# Altium schematic sheet generic 32u4.SchDoc
size B
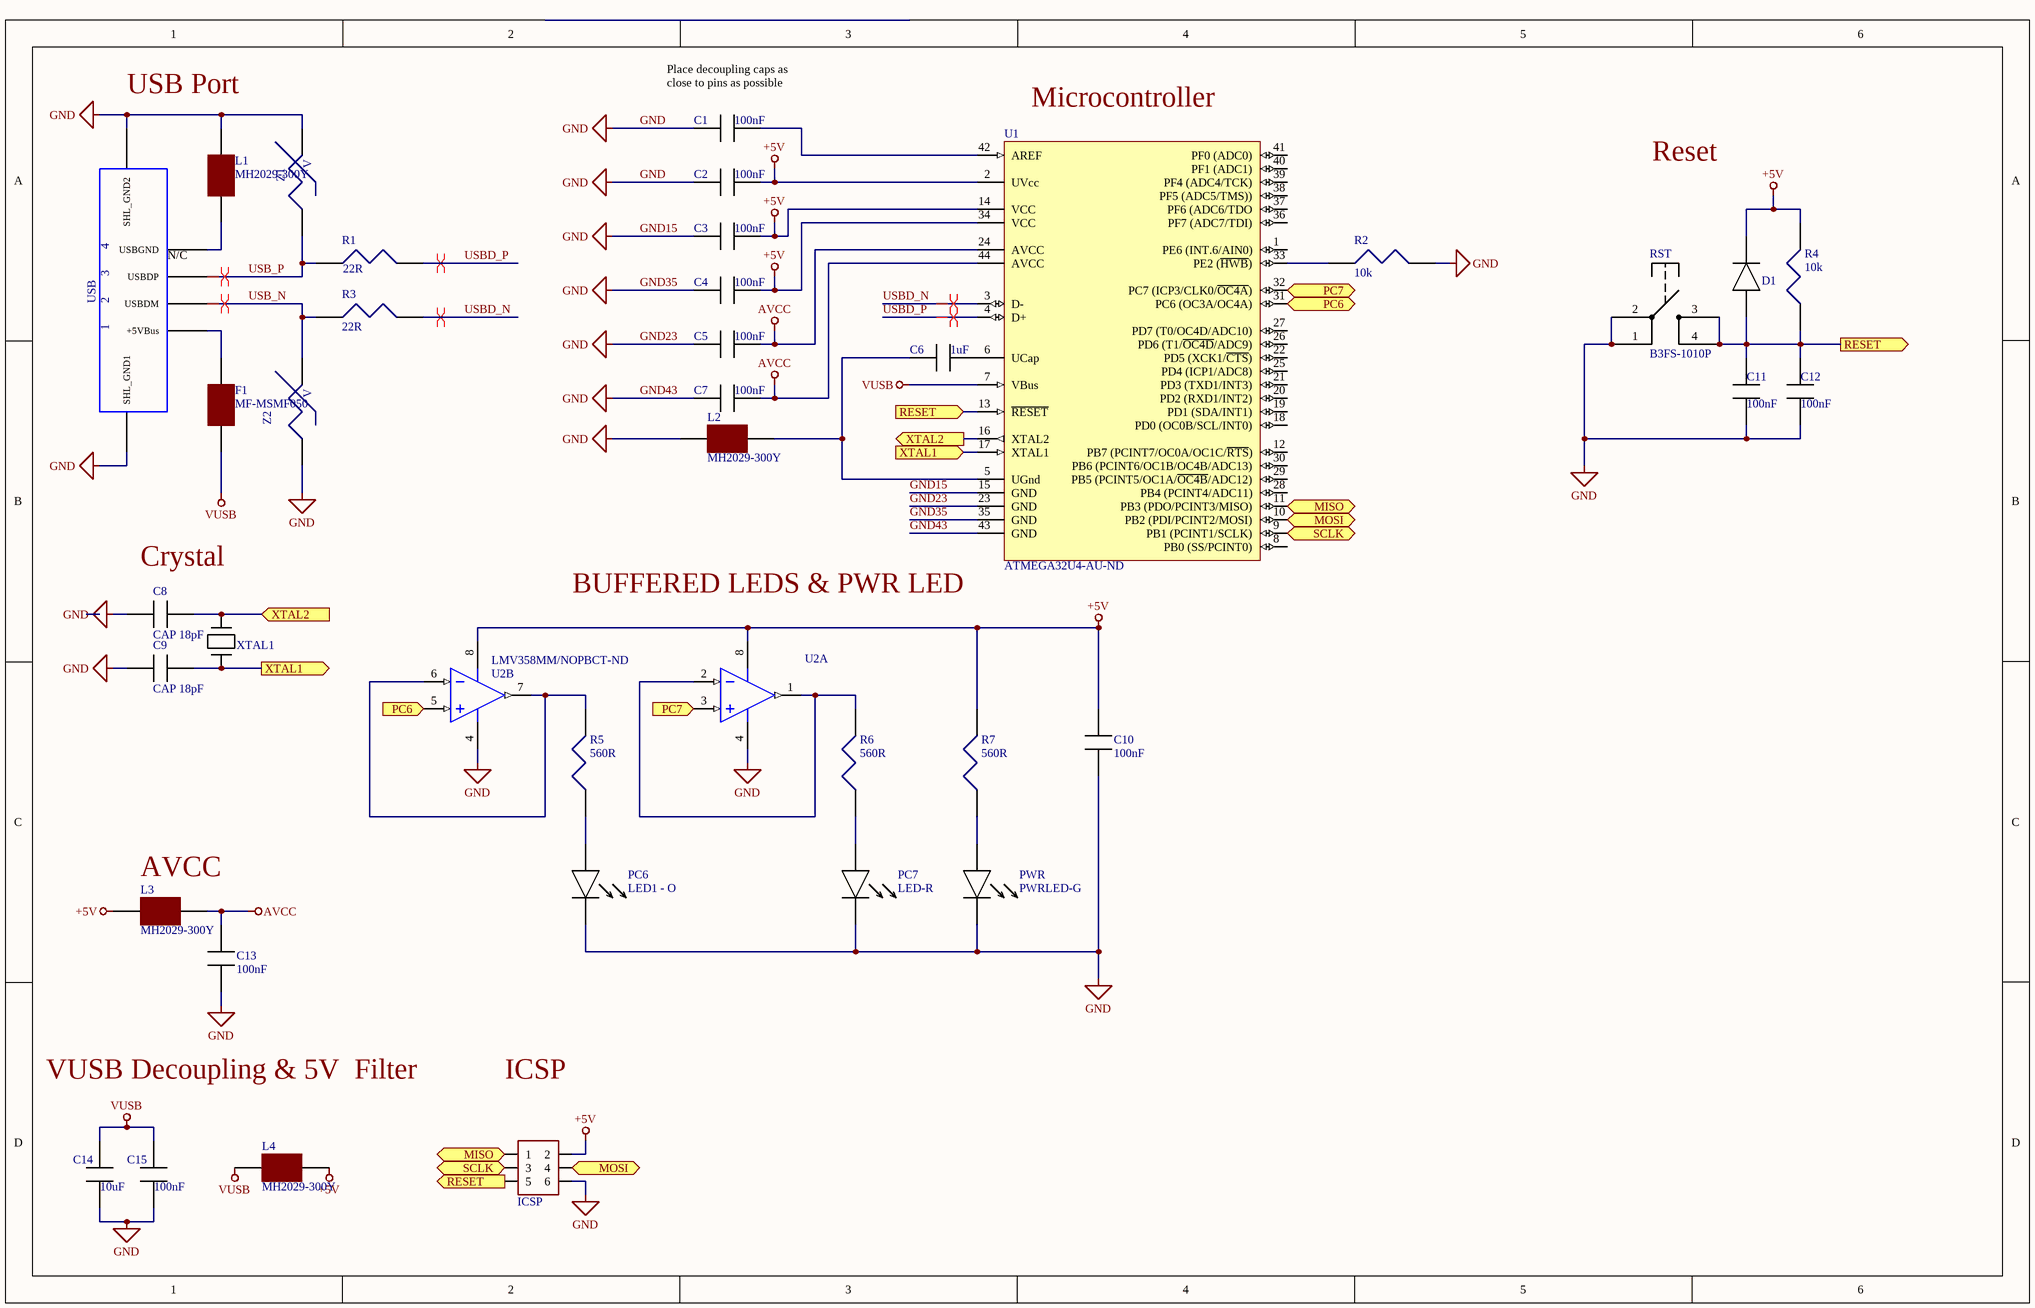
[diagram p0: generic 32u4.SchDoc]

## Parts
C1  100nF  [CAPC2012X09N]
C2  100nF  [CAPC2012X09N]
C3  100nF  [CAPC2012X09N]
C4  100nF  [CAPC2012X09N]
C5  100nF  [CAPC2012X09N]
C6  1uF  [CAPC2012X14N]
C7  100nF  [CAPC2012X09N]
C8  CAP 18pF  [CAPC2012X08N]
C9  CAP 18pF  [CAPC2012X08N]
C10  100nF  [CAPC2012X09N]
C11  100nF  [CAPC2012X09N]
C12  100nF  [CAPC2012X09N]
C13  100nF  [CAPC2012X09N]
C14  10uF  [CAPC2012X14N]
C15  100nF  [CAPC2012X09N]
D1  Diode 100V 150mA  [DIOC3215X09N]  (value not drawn)
F1  MF-MSMF050  [FUSE MF-MSMF050]
ICSP  67997-206HLF  [3x2 Pin Header]  (value not drawn)
L1  MH2029-300Y  [INDC2012X11N]
L2  MH2029-300Y  [INDC2012X11N]
L3  MH2029-300Y  [INDC2012X11N]
L4  MH2029-300Y  [INDC2012X11N]
PC6  LED1 - O  [0603LED]
PC7  LED-R  [0603LED]
PWR  PWRLED-G  [0603LED]
R1  22R  [RESC2012X07N]
R2  10k  [RESC2012X07N_SAMSUNG]
R3  22R  [RESC2012X07N]
R4  10k  [RESC2012X07N_SAMSUNG]
R5  560R  [RESC2012X07N_SAMSUNG]
R6  560R  [RESC2012X07N_SAMSUNG]
R7  560R  [RESC2012X07N_SAMSUNG]
RST  B3FS-1010P  [SWITCH]
U1  Supplier Part Number 1: ATMEGA32U4-AU-ND  [44ML_N]  (hidden comment: ATmega32U4-AU)
U2  LMV358MMX  [MUA08A_N]  (value not drawn)  (parts A,B of 2)
USB  USB  [USB B RECEPTACLE]  (value not drawn)
XTAL1  9C-16.000MEEJ-T  [XTAL]  (value not drawn)
Z1  CG0603MLC  [RESC1608X06N]  (value not drawn)
Z2  CG0603MLC  [RESC1608X06N]  (value not drawn)

## Ports
MISO, MOSI, PC6, PC7, RESET, SCLK, XTAL1, XTAL2

## Nets
+5V: C2.2 C3.1 C4.1 C10.2 D1.2 ICSP.2 L3.1 L4.2 R4.2 R7.2 U1.2(UVcc) U1.14(VCC) U1.34(VCC) U2.8(V+)
AVCC: C5.1 C7.1 C13.2 L3.2 U1.24(AVCC) U1.44(AVCC)
GND: C1.1 C2.1 C3.2 C4.2 C5.2 C7.2 C8.1 C9.1 C10.1 C11.1 C12.1 C13.1 C14.1 C15.1 ICSP.6 L1.2 L2.1 PC6.2 PC7.2 PWR.2 R2.2 RST.1 RST.2 U1.15(GND) U1.23(GND) U1.35(GND) U1.43(GND) U2.4(V-) USB.SHL_GND1 USB.SHL_GND2 Z1.2 Z2.1  [also labelled GND15, GND23, GND35, GND43]
VUSB: C14.2 C15.2 F1.1 L4.1 U1.7(VBus)
MISO: ICSP.1 U1.11(PB3_(PDO/PCINT3/MISO)) ; port MISO
MOSI: ICSP.4 U1.10(PB2_(PDI/PCINT2/MOSI)) ; port MOSI
PC6: U1.31(PC6_(OC3A/OC4A)) U2.5(INB+) ; port PC6
PC7: U1.32(PC7_(ICP3/CLK0/~{OC4A})) U2.3(INA+) ; port PC7
RESET: C11.2 C12.2 D1.1 ICSP.5 R4.1 RST.3 RST.4 U1.13(~{RESET}) ; port RESET
SCLK: ICSP.3 U1.9(PB1_(PCINT1/SCLK)) ; port SCLK
USB_N: R3.1 USB.USBDM Z2.2
USB_P: R1.1 USB.USBDP Z1.1
USBD_N: R3.2 U1.3(D-)
USBD_P: R1.2 U1.4(D+)
XTAL1: C9.2 U1.17(XTAL1) XTAL1.1 ; port XTAL1
XTAL2: C8.2 U1.16(XTAL2) XTAL1.2 ; port XTAL2
NetC1_2: C1.2 U1.42(AREF)
NetC6_1: C6.1 L2.2 U1.5(UGnd)
NetC6_2: C6.2 U1.6(UCap)
NetF1_2: F1.2 USB.+5VBus
NetL1_1: L1.1 USB.USBGND
NetPC6_1: PC6.1 R5.1
NetPC7_1: PC7.1 R6.1
NetPWR_1: PWR.1 R7.1
NetR2_1: R2.1 U1.33(PE2_(~{HWB}))
NetR5_2: R5.2 U2.6(INB-) U2.7(OUTB)
NetR6_2: R6.2 U2.1(OUTA) U2.2(INA-)

Not connected (* = marked no-connect by the designer): U1 1(PE6_(INT.6/AIN0)) 8(PB0_(SS/PCINT0)) 12(PB7_(PCINT7/OC0A/OC1C/~{RTS})) 18(PD0_(OC0B/SCL/INT0)) 19(PD1_(SDA/INT1)) 20(PD2_(RXD1/INT2)) 21(PD3_(TXD1/INT3)) 22(PD5_(XCK1/~{CTS})) 25(PD4_(ICP1/ADC8)) 26(PD6_(T1/~{OC4D}/ADC9)) 27(PD7_(T0/OC4D/ADC10)) 28(PB4_(PCINT4/ADC11)) 29(PB5_(PCINT5/OC1A/~{OC4B}/ADC12)) 30(PB6_(PCINT6/OC1B/OC4B/ADC13)) 36(PF7_(ADC7/TDI)) 37(PF6_(ADC6/TDO) 38(PF5_(ADC5/TMS))) 39(PF4_(ADC4/TCK)) 40(PF1_(ADC1)) 41(PF0_(ADC0))

## Layout directives
differential pair: USB_N, USB_P, USBD_N, USBD_P

## Notes on the sheet
- USB Port
- (near C1) Place decoupling caps as close to pins as possible
- (near U1) Microcontroller
- Reset
- (near USB) N/C
- Crystal
- BUFFERED LEDS & PWR LED
- (near L3) AVCC
- VUSB Decoupling & 5V  Filter
- ICSP
- (in symbol 61729-1011BLF) 3; 2; 1
- (in symbol CG0603MLC-05E) V

## Library data of the parts
C1-C5 C7 C10-C13 C15 = CL21F104ZBCNNNC: CAP CER 0.1UF 50V Y5V 0805; Manufacturer: Samsung Electro-Mechanics America, Inc.; Capacitance: 0.10µF; Tolerance: -20%, +80%; Temperature Coefficient: Y5V (F); Supplier 1: Digi-Key; Manufacturer Part Number: CL21F104ZBCNNNC; RoHS: RoHS Compliant; Category: Capacitors; Stock 1: 1030146; Pricing 1: 1=0.1, 10=0.031, 25=0.022, 50=0.017, 100=0.0144, 500=0.01004, 1000=0.00783 (USD); Packaging: Cut Tape (CT); Voltage - Rated: 50V; Mounting Type: Surface Mount, MLCC; Operating Temperature: -30°C ~ 85°C; Applications: General Purpose; Ratings: -; Package / Case: 0805 (2012 Metric); Size / Dimension: 0.079" L x 0.049" W (2.00mm x 1.25mm); Height - Seated (Max): -; Thickness (Max): 0.037" (0.95mm); Lead Spacing: -; Features: -; Lead Style: -; ComponentLink1URL: http://www.samsungsem.com/kr/support/product-search/mlcc/CL21F104ZBCNNNC.jsp; ComponentLink1Description: http://www.samsungsem.com/kr/support/product-search/mlcc/CL21F104ZBCNNNC.jsp; Supplier Part Number 1: 1276-1007-1-ND
C6 = CL21A105KBCLNNC: CAP CER 1UF 50V X5R 0805; Manufacturer: Samsung Electro-Mechanics America, Inc.; Capacitance: 1µF; Tolerance: ±10%; Supplier 1: Digi-Key; Manufacturer Part Number: CL21A105KBCLNNC; RoHS: RoHS Compliant; Category: Capacitors; Stock 1: 6541; Pricing 1: 1=0.26, 10=0.216, 25=0.1484, 50=0.1216, 100=0.108, 500=0.07156, 1000=0.06345 (USD); Packaging: Cut Tape (CT); Voltage - Rated: 50V; Temperature Coefficient: X5R; Mounting Type: Surface Mount, MLCC; Operating Temperature: -55°C ~ 85°C; Applications: General Purpose; Ratings: -; Package / Case: 0805 (2012 Metric); Size / Dimension: 0.079" L x 0.049" W (2.00mm x 1.25mm); Height - Seated (Max): -; Thickness (Max): 0.037" (0.95mm); Lead Spacing: -; Features: -; Lead Style: -; ComponentLink1URL: http://media.digikey.com/pdf/Data%20Sheets/Samsung%20PDFs/CL21A105KBCLNNC_Spec.pdf; ComponentLink1Description: http://media.digikey.com/pdf/Data%20Sheets/Samsung%20PDFs/CL21A105KBCLNNC_Spec.pdf; Supplier Part Number 1: 1276-2396-1-ND
C8 C9 = CL21C180JBANNNC: CAP CER 18PF 50V NP0 0805; Manufacturer: Samsung Electro-Mechanics America, Inc.; Tolerance: ±5%; Temperature Coefficient: C0G, NP0; Supplier 1: Digi-Key; Manufacturer Part Number: CL21C180JBANNNC; RoHS: RoHS Compliant; Category: Capacitors; Stock 1: 75846; Pricing 1: 1=0.1, 10=0.048, 25=0.034, 50=0.026, 100=0.022, 500=0.0154, 1000=0.012 (USD); Packaging: Cut Tape (CT); Capacitance: 18pF; Voltage - Rated: 50V; Mounting Type: Surface Mount, MLCC; Operating Temperature: -55°C ~ 125°C; Applications: General Purpose; Ratings: -; Package / Case: 0805 (2012 Metric); Size / Dimension: 0.079" L x 0.049" W (2.00mm x 1.25mm); Height - Seated (Max): -; Thickness (Max): 0.030" (0.75mm); Lead Spacing: -; Features: -; Lead Style: -; ComponentLink1URL: http://www.samsungsem.com/kr/support/product-search/mlcc/CL21C180JBANNNC.jsp; ComponentLink1Description: http://www.samsungsem.com/kr/support/product-search/mlcc/CL21C180JBANNNC.jsp; Supplier Part Number 1: 1276-1107-1-ND
C14 = CL21A106KAYNNNE: CAP CER 10UF 25V X5R 0805; Manufacturer: Samsung Electro-Mechanics America, Inc.; Capacitance: 10µF; Tolerance: ±10%; Supplier 1: Digi-Key; Manufacturer Part Number: CL21A106KAYNNNE; RoHS: RoHS Compliant; Category: Capacitors; Stock 1: 312876; Pricing 1: 1=0.24, 10=0.165, 25=0.12, 50=0.1, 100=0.084, 500=0.06, 1000=0.051 (USD); Packaging: Cut Tape (CT); Voltage - Rated: 25V; Temperature Coefficient: X5R; Mounting Type: Surface Mount, MLCC; Operating Temperature: -55°C ~ 85°C; Applications: General Purpose; Ratings: -; Package / Case: 0805 (2012 Metric); Size / Dimension: 0.079" L x 0.049" W (2.00mm x 1.25mm); Height - Seated (Max): -; Thickness (Max): 0.057" (1.45mm); Lead Spacing: -; Features: -; Lead Style: -; ComponentLink1URL: http://www.samsungsem.com/kr/support/product-search/mlcc/CL21A106KAYNNNE.jsp; ComponentLink1Description: http://www.samsungsem.com/kr/support/product-search/mlcc/CL21A106KAYNNNE.jsp; Supplier Part Number 1: 1276-2891-1-ND
D1 = CD1206-S01575: DIODE GEN PURP 100V 150MA 1206; Manufacturer: Bourns Inc.; Diode Type: Standard; Voltage - Forward (Vf) (Max) @ If: 1V @ 50mA; Speed: Small Signal =< 200mA (Io), Any Speed; Reverse Recovery Time (trr): 4ns; Current - Reverse Leakage @ Vr: 2.5µA @ 100V; Capacitance @ Vr, F: 3pF @ 0V, 100MHz; Supplier 1: Digi-Key; Manufacturer Part Number: CD1206-S01575; RoHS: RoHS Compliant; Category: Discrete Semiconductor Products; Stock 1: 15991; Pricing 1: 1=0.15, 10=0.142, 25=0.1288, 100=0.0927, 250=0.0546, 500=0.0453, 1000=0.0309, 2500=0.0263 (USD); Packaging: Cut Tape (CT); Voltage - DC Reverse (Vr) (Max): 100V; Current - Average Rectified (Io): 150mA; Mounting Type: Surface Mount; Package / Case: 1206 (3216 Metric); Supplier Device Package: 1206; Operating Temperature - Junction: -55°C ~ 125°C; ComponentLink1URL: http://www.bourns.com/docs/Product-Datasheets/CD1206_S01575.pdf; ComponentLink1Description: http://www.bourns.com/docs/Product-Datasheets/CD1206_S01575.pdf; Supplier Part Number 1: CD1206-S01575CT-ND
F1 = MF-MSMF050-2: PTC RESETTABLE .50A 15V 1812; Manufacturer: Bourns Inc.; Current - Max: 100A; Current - Hold (Ih) (Max): 500mA; Current - Trip (It): 1A; R Min/Max: 0.150 ~ 1.000 Ohm; Time to Trip: 0.15s; Supplier 1: Digi-Key; Manufacturer Part Number: MF-MSMF050-2; RoHS: RoHS Compliant; Category: Circuit Protection; Stock 1: 97387; Pricing 1: 1=0.22, 10=0.201, 25=0.186, 50=0.1794, 100=0.167, 250=0.14868, 500=0.1239, 1000=0.11741 (USD); Packaging: Cut Tape (CT); Voltage - Max: 15V; Package / Case: 1812 (4532 Metric), Concave; ComponentLink1URL: http://www.bourns.com/docs/Product-Datasheets/mfmsmf.pdf; ComponentLink1Description: http://www.bourns.com/docs/Product-Datasheets/mfmsmf.pdf; Supplier Part Number 1: MF-MSMF050-2CT-ND
ICSP = 67997-206HLF: CONN HEADER 6POS .100 STR 15AU; Manufacturer: Amphenol FCI; Connector Type: Header, Unshrouded; Number of Positions: 6; Number of Positions Loaded: All; Pitch: 0.100" (2.54mm); Supplier 1: Digi-Key; Manufacturer Part Number: 67997-206HLF; RoHS: RoHS Compliant; Category: Connectors, Interconnects; Stock 1: 15596; Pricing 1: 1=0.31, 10=0.292, 25=0.2504, 100=0.2046, 250=0.18372, 500=0.17536, 1000=0.14613, 2500=0.1336, 5000=0.12525 (USD); Packaging: Bulk; Contact Type: Male Pin; Number of Rows: 2; Row Spacing: 0.100" (2.54mm); Contact Mating Length: 0.230" (5.84mm); Mounting Type: Through Hole; Termination: Solder; Fastening Type: -; Features: -; Contact Finish: Gold or Gold, GXT™; Contact Finish Thickness: 15µin (0.38µm); Color: Black; ComponentLink1URL: http://portal.fciconnect.com/Comergent//fci/drawing/67996.pdf; ComponentLink1Description: http://portal.fciconnect.com/Comergent//fci/drawing/67996.pdf; Supplier Part Number 1: 609-3234-ND
L1-L4 = MH2029-300Y: EMI Filter Beads, Chips & Arrays Impedance 30ohms IDC 3.0; Manufacturer: Bourns; Maximum DC Current: 3 A; Maximum DC Resistance: 25 mOhms; Tolerance: 25 %; Type: High Current Chip Ferrite Bead; Test Frequency: 100 MHz; Filter Type: Power, Signal Line; Number of Lines: 1; Impedance @ Frequency: 30 Ohm @ 100MHz; Current Rating (Max): 3A; DC Resistance (DCR) (Max): 25 mOhm; Supplier 1: Digi-Key; Manufacturer Part Number: MH2029-300Y; RoHS: RoHS Compliant; Category: EMI Filter Beads, Chips & Arrays; Stock 1: 62738; Pricing 1: 1=0.1, 10=0.062, 25=0.0568, 50=0.051, 100=0.0375, 250=0.02724, 500=0.02498, 1000=0.02157 (USD); Capacitance: -; Height: 0.9 mm; Impedance: 30 Ohms; Length: 2 mm; Operating Temperature Range: - 55 C to + 125 C; Package / Case: 0805 (2012 metric); Packaging: Reel; Product: Ferrite Chip Beads; Termination Style: SMD/SMT; Width: 1.2 mm; Brand: Bourns; Product Category: SMD Ferrite Bead; Standard Pack Qty: 4000; RoHS - Mouser: Y; Minimum Order Quantity: 1; Reeling: True; ComponentLink1URL: http://www.mouser.com/ds/2/54/h-777565.pdf; ComponentLink1Description: http://www.mouser.com/ds/2/54/h-777565.pdf; Supplier Part Number 1: MH2029-300YCT-ND; Ratings: -; Operating Temperature: -55°C ~ 125°C; Mounting Type: Surface Mount; Height (Max): 0.043" (1.10mm); Size / Dimension: 0.079" L x 0.047" W (2.00mm x 1.20mm); ComponentLink2URL: http://www.bourns.com/docs/Product-Datasheets/mh.pdf; ComponentLink2Description: http://www.bourns.com/docs/Product-Datasheets/mh.pdf
PC6 = LO L29K-J2L1-24-Z: LED ORANGE DIFFUSED 0603 SMD; Manufacturer: OSRAM Opto Semiconductors Inc.; Lens Color: White; Millicandela Rating: 9.8mcd; Lens Style/Size: Rectangle with Flat Top, 1.30mm x 0.80mm; Voltage - Forward (Vf) (Typ): 1.8V; Current - Test: 2mA; Viewing Angle: 160°; Wavelength - Dominant: 606nm; Wavelength - Peak: 610nm; Supplier 1: Digi-Key; Manufacturer Part Number: LO L29K-J2L1-24-Z; RoHS: RoHS Compliant; Category: Optoelectronics; Stock 1: 18543; Pricing 1: 1=0.33, 10=0.257, 25=0.2096, 100=0.1666, 250=0.14284, 500=0.12378, 1000=0.09522, 2500=0.0857 (USD); Packaging: Cut Tape (CT); Color: Orange; Lens Transparency: Diffused; Mounting Type: Surface Mount; Features: -; Package / Case: 0603 (1608 Metric); Supplier Device Package: *; Size / Dimension: 1.70mm L x 0.80mm W; Height (Max): 0.65mm; ComponentLink1URL: http://www.osram-os.com/Graphics/XPic0/00077105_0.pdf; ComponentLink1Description: http://www.osram-os.com/Graphics/XPic0/00077105_0.pdf; Supplier Part Number 1: 475-1194-1-ND
PC7 = LS L29K-H1J2-1-Z: LED RED DIFFUSED 0603 SMD; Manufacturer: OSRAM Opto Semiconductors Inc.; Lens Color: White; Millicandela Rating: 4.95mcd; Lens Style/Size: Rectangle with Flat Top, 1.30mm x 0.80mm; Voltage - Forward (Vf) (Typ): 1.8V; Current - Test: 2mA; Viewing Angle: 160°; Wavelength - Dominant: 630nm; Wavelength - Peak: 643nm; Supplier 1: Digi-Key; Manufacturer Part Number: LS L29K-H1J2-1-Z; RoHS: RoHS Compliant; Category: Optoelectronics; Stock 1: 77723; Pricing 1: 1=0.33, 10=0.257, 25=0.2096, 100=0.1666, 250=0.14284, 500=0.12378, 1000=0.09522, 2500=0.0857 (USD); Packaging: Cut Tape (CT); Color: Red; Lens Transparency: Diffused; Mounting Type: Surface Mount; Features: -; Package / Case: 0603 (1608 Metric); Supplier Device Package: *; Size / Dimension: 1.70mm L x 0.80mm W; Height (Max): 0.65mm; ComponentLink1URL: http://www.osram-os.com/Graphics/XPic2/00077099_0.pdf; ComponentLink1Description: http://www.osram-os.com/Graphics/XPic2/00077099_0.pdf; Supplier Part Number 1: 475-1195-1-ND
PWR = LG L29K-F2J1-24: LED GREEN DIFFUSED 0603 SMD; Manufacturer: OSRAM Opto Semiconductors Inc.; Lens Color: White; Millicandela Rating: 3.5mcd; Lens Style/Size: Rectangle with Flat Top, 1.30mm x 0.80mm; Voltage - Forward (Vf) (Typ): 1.7V; Current - Test: 2mA; Viewing Angle: 160°; Wavelength - Dominant: 570nm; Wavelength - Peak: 572nm; Supplier 1: Digi-Key; Manufacturer Part Number: LG L29K-F2J1-24; RoHS: RoHS Compliant; Category: Optoelectronics; Stock 1: 30762; Pricing 1: 1=0.38, 10=0.266, 25=0.2184, 100=0.1746, 250=0.13092, 500=0.11902, 1000=0.09522, 2500=0.07737 (USD); Packaging: Cut Tape (CT); Color: Green; Lens Transparency: Diffused; Mounting Type: Surface Mount; Features: -; Package / Case: 0603 (1608 Metric); Supplier Device Package: *; Size / Dimension: 1.70mm L x 0.80mm W; Height (Max): 0.65mm; ComponentLink1URL: http://www.osram-os.com/Graphics/XPic2/00077107_0.pdf; ComponentLink1Description: http://www.osram-os.com/Graphics/XPic2/00077107_0.pdf; Supplier Part Number 1: 475-1193-1-ND
R1 R3 = ERJ-6ENF22R0V: RES SMD 22 OHM 1% 1/8W 0805; Manufacturer: Panasonic Electronic Components; Resistance (Ohms): 22; Power (Watts): 0.125W, 1/8W; Temperature Coefficient: ±100ppm/°C; Supplier 1: Digi-Key; Manufacturer Part Number: ERJ-6ENF22R0V; RoHS: RoHS Compliant; Category: Resistors; Stock 1: 168629; Pricing 1: 1=0.1, 50=0.022, 100=0.0162, 250=0.01236, 500=0.0099, 1000=0.00729 (USD); Packaging: Cut Tape (CT); Tolerance: ±1%; Composition: Thick Film; Features: Automotive AEC-Q200; Operating Temperature: -55°C ~ 155°C; Package / Case: 0805 (2012 Metric); Supplier Device Package: 0805; Size / Dimension: 0.079" L x 0.049" W (2.00mm x 1.25mm); Height: 0.028" (0.70mm); Number of Terminations: 2; ComponentLink1URL: http://industrial.panasonic.com/www-cgi/jvcr13pz.cgi?E+PZ+3+AOA0002+ERJ6ENF22R0V+7+WW; ComponentLink1Description: http://industrial.panasonic.com/www-cgi/jvcr13pz.cgi?E+PZ+3+AOA0002+ERJ6ENF22R0V+7+WW; Supplier Part Number 1: P22.0CCT-ND
R2 R4 = RC2012F103CS: RES SMD 10K OHM 1% 1/8W 0805; Manufacturer: Samsung Electro-Mechanics America, Inc.; Power (Watts): 0.125W, 1/8W; Temperature Coefficient: ±100ppm/°C; Supplier 1: Digi-Key; Manufacturer Part Number: RC2012F103CS; RoHS: RoHS Compliant; Category: Resistors; Stock 1: 234992; Pricing 1: 1=0.1, 10=0.022, 25=0.016, 50=0.0124, 100=0.0091, 500=0.00554, 1000=0.00408 (USD); Packaging: Cut Tape (CT); Resistance (Ohms): 10k; Tolerance: ±1%; Composition: Thick Film; Features: Moisture Resistant; Operating Temperature: -55°C ~ 155°C; Package / Case: 0805 (2012 Metric); Supplier Device Package: 0805 (2012 Metric); Size / Dimension: 0.079" L x 0.049" W (2.00mm x 1.25mm); Height: 0.024" (0.60mm); Number of Terminations: 2; ComponentLink1URL: http://media.digikey.com/pdf/Data%20Sheets/Samsung%20PDFs/RC_Series_ds.pdf; ComponentLink1Description: http://media.digikey.com/pdf/Data%20Sheets/Samsung%20PDFs/RC_Series_ds.pdf; Supplier Part Number 1: 1276-5332-1-ND
R5-R7 = RC2012F561CS: RES SMD 560 OHM 1% 1/8W 0805; Manufacturer: Samsung Electro-Mechanics America, Inc.; Resistance (Ohms): 560; Power (Watts): 0.125W, 1/8W; Temperature Coefficient: ±100ppm/°C; Supplier 1: Digi-Key; Manufacturer Part Number: RC2012F561CS; RoHS: RoHS Compliant; Category: Resistors; Stock 1: 12893; Pricing 1: 1=0.1, 10=0.022, 25=0.016, 50=0.0124, 100=0.0091, 500=0.00554, 1000=0.00408 (USD); Packaging: Cut Tape (CT); Tolerance: ±1%; Composition: Thick Film; Features: Moisture Resistant; Operating Temperature: -55°C ~ 155°C; Package / Case: 0805 (2012 Metric); Supplier Device Package: 0805 (2012 Metric); Size / Dimension: 0.079" L x 0.049" W (2.00mm x 1.25mm); Height: 0.024" (0.60mm); Number of Terminations: 2; ComponentLink1URL: http://media.digikey.com/pdf/Data%20Sheets/Samsung%20PDFs/RC_Series_ds.pdf; ComponentLink1Description: http://media.digikey.com/pdf/Data%20Sheets/Samsung%20PDFs/RC_Series_ds.pdf; Supplier Part Number 1: 1276-5257-1-ND
RST = B3FS-1010P: SWITCH TACTILE SPST-NO 0.05A 24V; Manufacturer: Omron Electronics Inc-EMC Div; Switch Function: Off-Mom; Contact Rating @ Voltage: 0.05A @ 24VDC; Actuator Type: Standard; Actuator Height off PCB, from Pins: 4.30mm; Actuator Orientation: Top Actuated; Outline: 6.30mm x 6.00mm; Illumination: Non-Illuminated; Operating Force: 100gf; Switch Travel: 0.25mm; Mechanical Life: 1,000,000 Cycles; Supplier 1: Digi-Key; Manufacturer Part Number: B3FS-1010P; RoHS: RoHS Compliant; Category: Switches; Stock 1: 30103; Pricing 1: 1=0.79, 10=0.76, 25=0.7168, 50=0.6308, 100=0.5735, 250=0.54488, 500=0.53052 (USD); Packaging: Cut Tape (CT); Circuit: SPST-NO; Mounting Type: Surface Mount; Termination Style: Gull Wing; Illumination Voltage (Nominal): -; Illumination Type, Color: -; Ingress Protection: -; Features: -; Actuator Material: -; Operating Temperature: -25°C ~ 70°C; ComponentLink1URL: http://www.omron.com/ecb/products/pdf/en-b3fs.pdf; ComponentLink1Description: http://www.omron.com/ecb/products/pdf/en-b3fs.pdf; Supplier Part Number 1: SW1440CT-ND
U1 = CMP-0095-00285-2: 8-bit AVR Microcontroller, 2.7-5.5V, 16MHz, 32KB Flash, 1KB EEPROM, 2.5KB SRAM, USB Controller, 44-pin TQFP, Industrial Grade (-40°C to 85°C), Ext Osc; Manufacturer: Atmel; Connectivity: I²C, SPI, UART/USART, USB; Peripherals: Brown-out Detect/Reset, POR, PWM, WDT; Number of I/O: 26; Program Memory Size: 32KB (16K x 16); EEPROM Size: 1K x 8; RAM Size: 2.5K x 8; Voltage - Supply (Vcc/Vdd): 2.7 V ~ 5.5 V; Data Converters: A/D 12x10b; Oscillator Type: Internal; RevisionNote: DatasheetVersion updated. URLs added.; ComponentLink1Description: Manufacturer URL; PackageDescription: 44-Pin Plastic Thin Quad Flat Pack, 10 x 10 x 1.0 mm Body, 0.8 mm Pitch (TQFP); DatasheetVersion: revF, Nov-2010; ComponentLink2URL: http://www.atmel.com/dyn/resources/prod_documents/doc7766.pdf; ComponentLink1URL: http://www.atmel.com/; PackageReference: 44ML; ComponentLink2Description: ATmega16U4/32U4 Datasheet; PackageVersion: rev.G, Jul-2007; ComponentLink3URL: http://www.atmel.com/dyn/resources/prod_documents/7766S.pdf; ComponentLink3Description: ATmega16U4 ATmega32U4 Summary; Supplier 1: Digi-Key; Manufacturer Part Number: ATMEGA32U4-AU; RoHS: RoHS Compliant; Category: Integrated Circuits (ICs); Stock 1: 3024; Pricing 1: 1=6.32, 10=5.684, 25=5.1788, 100=4.6737, 250=4.29472, 500=3.91576, 1000=3.50875 (USD); Packaging: Tray; Core Processor: AVR; Core Size: 8-Bit; Speed: 16MHz; Program Memory Type: FLASH; Operating Temperature: -40°C ~ 85°C (TA); Package / Case: 44-TQFP; Supplier Device Package: 44-TQFP (10x10); ComponentLink4URL: http://media.digikey.com/pdf/Data%20Sheets/Atmel%20PDFs/ATmega16U4,32U4.pdf; ComponentLink4Description: http://media.digikey.com/pdf/Data%20Sheets/Atmel%20PDFs/ATmega16U4,32U4.pdf
U2 = CMP-0055-01464-2: General Purpose, Low Voltage, Rail-to-Rail Output Operational Amplifiers, 8-pin Mini SOIC; Manufacturer: National Semiconductor; Manufacturer Part Number: LMV358MM/NOPB; PackageTopMarking: ZXTT*V358; PowerWise: N; Number of Circuits: 2; Slew Rate: 1 V/µs; Gain Bandwidth Product: 1MHz; Current - Input Bias: 15nA; Voltage - Input Offset: 1.7mV; Current - Supply: 210µA; Current - Output / Channel: 160mA; Voltage - Supply, Single/Dual (±): 2.7 V ~ 5.5 V, ±1.35 V ~ 2.75 V; RoHS: N; ComponentLink3Description: MUA08A Package Page; PackageReference: MUA08A; RevisionNote: Component URLs added; ComponentLink3URL: http://www.national.com/packaging/folders/mua08a.html; PinCount: 8; ComponentLink2URL: http://www.national.com/pf/LM/LMV358.html; DatasheetVersion: Sep-2009; PackageVersion: revF, Apr-2008; PackageDescription: MINI SOIC, .118 x .118 x .034in, 8 Lead, .0256in Pitch; ComponentLink1URL: http://www.national.com/ds/LM/LMV358.pdf; Code_JEDEC: MO-187-AA; ComponentLink1Description: LMV358 Datasheet; CompType: Amplifiers; ComponentLink2Description: LMV358 Web Page; PartId: 1; Supplier 1: Digi-Key; Category: Integrated Circuits (ICs); Stock 1: 7144; Pricing 1: 1=0.87, 10=0.765, 100=0.585, 500=0.4635, 1000=0.28125 (USD); Packaging: Cut Tape (CT); Amplifier Type: General Purpose; Output Type: Rail-to-Rail; -3db Bandwidth: -; Operating Temperature: -40°C ~ 85°C; Mounting Type: Surface Mount; Package / Case: 8-TSSOP, 8-MSOP (0.118", 3.00mm Width); Supplier Device Package: 8-VSSOP; ComponentLink4URL: http://www.ti.com/lit/ds/symlink/lmv321-n.pdf; ComponentLink4Description: http://www.ti.com/lit/ds/symlink/lmv321-n.pdf; Supplier Part Number 1: LMV358MM/NOPBCT-ND
USB = 61729-1011BLF: USB RCPT B-TYPE R/A FULL BACK; Manufacturer: Amphenol FCI; Connector Type: USB - B; Number of Contacts: 4; Gender: Receptacle; Specifications: USB 2.0; Supplier 1: Digi-Key; Manufacturer Part Number: 61729-1011BLF; RoHS: RoHS Compliant; Category: Connectors, Interconnects; Stock 1: 7879; Pricing 1: 1=0.92, 10=0.806, 50=0.7268, 100=0.6952, 250=0.632, 500=0.5688, 1000=0.5056, 2500=0.4582, 5000=0.4424 (USD); Packaging: Tube; Mounting Type: Through Hole, Right Angle, Horizontal; Features: Board Lock, Shielded; Ingress Protection: -; ComponentLink1URL: http://portal.fciconnect.com/Comergent//fci/drawing/61729.pdf; ComponentLink1Description: http://portal.fciconnect.com/Comergent//fci/drawing/61729.pdf; Supplier Part Number 1: 609-3657-ND
XTAL1 = 9C-16.000MEEJ-T: CRYSTAL 16.0000MHZ 18PF SMD; Manufacturer: TXC CORPORATION; Frequency: 16MHz; Frequency Stability: ±10ppm; ESR (Equivalent Series Resistance): 30 Ohm; Operating Mode: Fundamental; Supplier 1: Digi-Key; Manufacturer Part Number: 9C-16.000MEEJ-T; RoHS: RoHS Compliant; Category: Crystals and Oscillators; Stock 1: 6530; Pricing 1: 1=0.57, 10=0.473, 50=0.4248, 100=0.378, 500=0.36 (USD); Packaging: Cut Tape (CT); Type: MHz Crystal; Frequency Tolerance: ±10ppm; Load Capacitance: 18pF; Operating Temperature: -20°C ~ 70°C; Ratings: -; Mounting Type: Surface Mount; Package / Case: HC49/US; Size / Dimension: 0.449" L x 0.189" W (11.40mm x 4.80mm); Height: 0.161" (4.10mm); ComponentLink1URL: http://www.txccrystal.com/images/pdf/9c-accuracy.pdf; ComponentLink1Description: http://www.txccrystal.com/images/pdf/9c-accuracy.pdf; Supplier Part Number 1: 887-1274-1-ND
Z1 Z2 = CG0603MLC-05E: VARISTOR 0603; Manufacturer: Bourns Inc.; Number of Circuits: 1; Maximum DC Volts: 5VDC; Supplier 1: Digi-Key; Manufacturer Part Number: CG0603MLC-05E; RoHS: RoHS Compliant; Category: Circuit Protection; Stock 1: 177838; Pricing 1: 1=0.19, 10=0.177, 25=0.164, 50=0.158, 100=0.1472, 250=0.13104, 500=0.1092, 1000=0.10348, 2500=0.09256 (USD); Packaging: Cut Tape (CT); Varistor Voltage (Min): -; Varistor Voltage (Typ): -; Varistor Voltage (Max): -; Current - Surge: -; Maximum AC Volts: -; Energy: -; Package / Case: 0603 (1608 Metric); Mounting Type: Surface Mount, MLCV; ComponentLink1URL: http://www.bourns.com/docs/Product-Datasheets/MLC.pdf; ComponentLink1Description: http://www.bourns.com/docs/Product-Datasheets/MLC.pdf; Supplier Part Number 1: CG0603MLC-05ECT-ND